# EAGLE design axocore_top_from_mech (EAGLE 7.4.0)
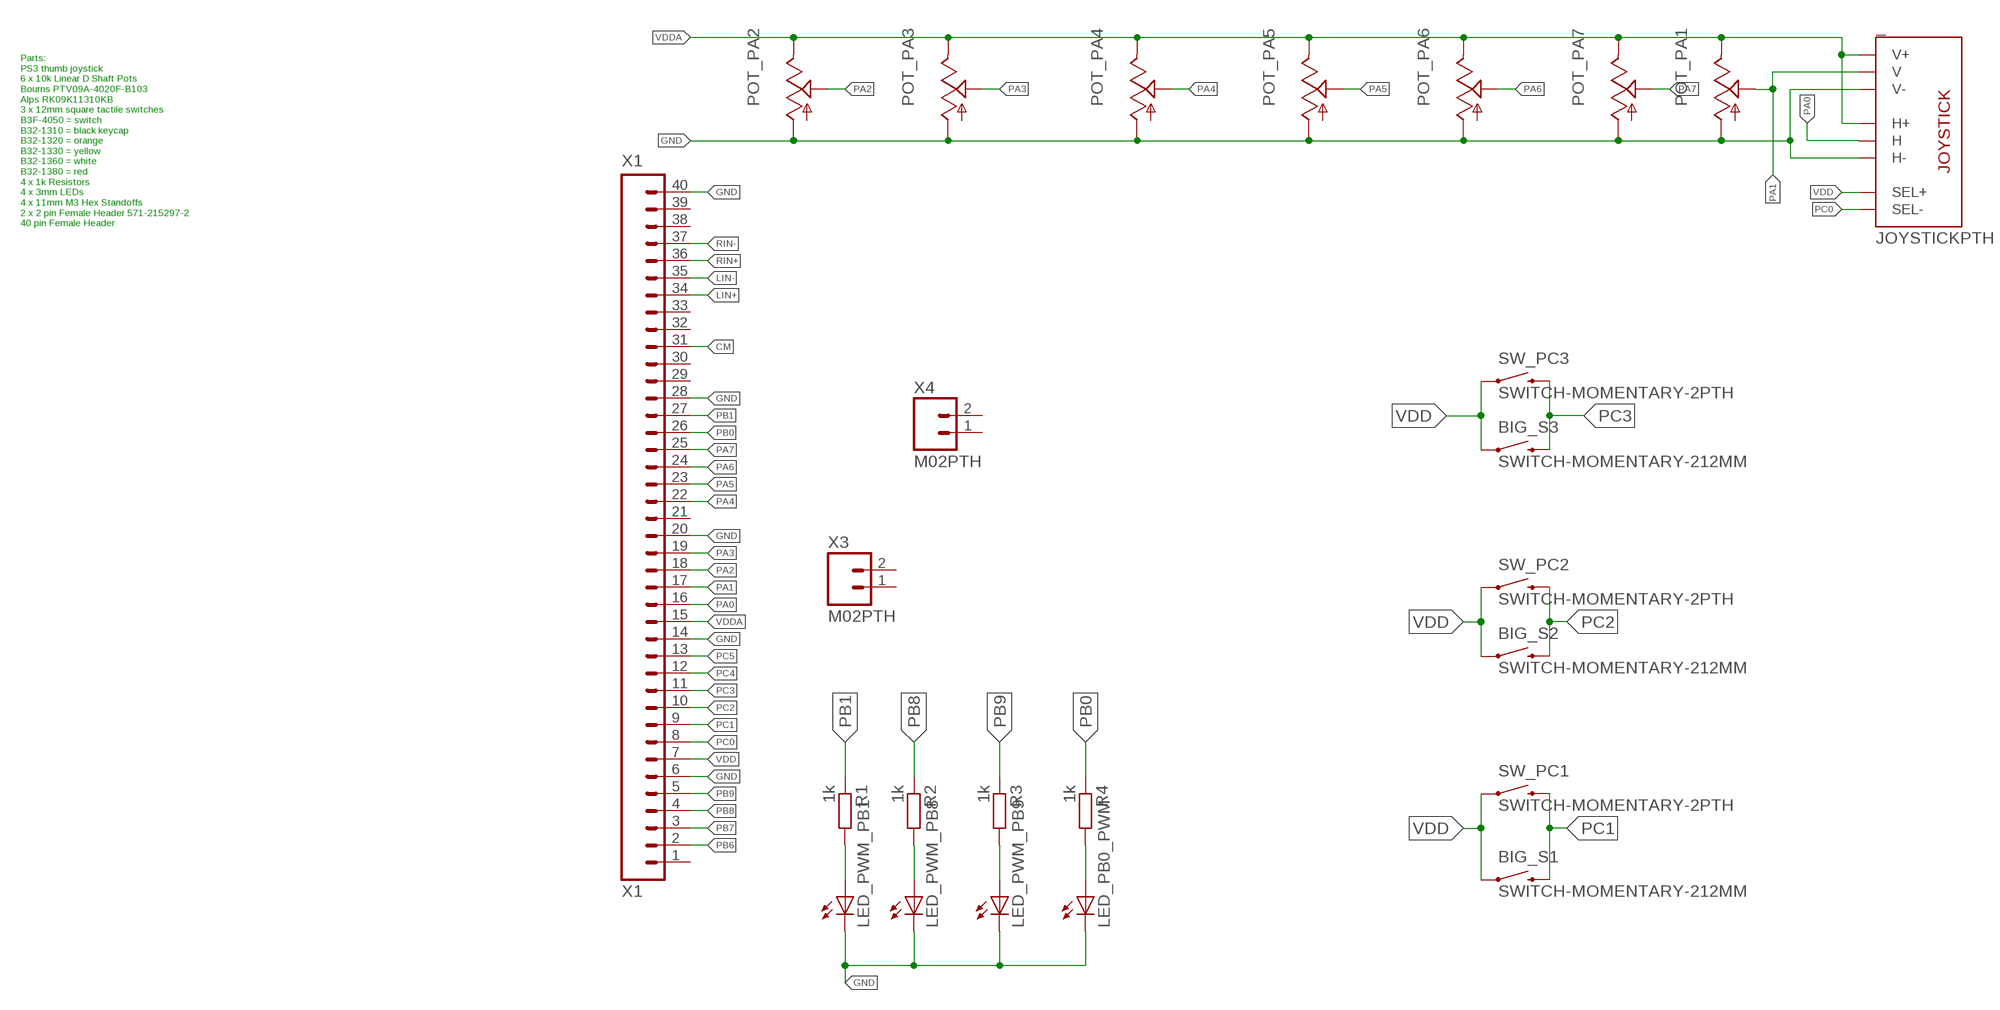
[diagram p0: schematic, sheet 1]

## Parts
_  JOYSTICKPTH  [JOYSTICK]
BIG_S1  SWITCH-MOMENTARY-212MM  [TACTILE-PTH-12MM]
BIG_S2  SWITCH-MOMENTARY-212MM  [TACTILE-PTH-12MM]
BIG_S3  SWITCH-MOMENTARY-212MM  [TACTILE-PTH-12MM]
LED_PB0_PWM  LED3MM  [LED3MM]
LED_PWM_PB1  LED3MM  [LED3MM]
LED_PWM_PB8  LED3MM  [LED3MM]
LED_PWM_PB9  LED3MM  [LED3MM]
POT_PA1  9MM_SNAP-IN_POT_  [9MM_SNAP-IN_POT]
POT_PA2  9MM_SNAP-IN_POT_  [9MM_SNAP-IN_POT]
POT_PA3  9MM_SNAP-IN_POT_  [9MM_SNAP-IN_POT]
POT_PA4  9MM_SNAP-IN_POT_  [9MM_SNAP-IN_POT]
POT_PA5  9MM_SNAP-IN_POT_  [9MM_SNAP-IN_POT]
POT_PA6  9MM_SNAP-IN_POT_  [9MM_SNAP-IN_POT]
POT_PA7  9MM_SNAP-IN_POT_  [9MM_SNAP-IN_POT]
R1  1k  RESISTOR7MM  [7MM_RESISTOR]
R2  1k  RESISTOR7MM  [7MM_RESISTOR]
R3  1k  RESISTOR7MM  [7MM_RESISTOR]
R4  1k  RESISTOR7MM  [7MM_RESISTOR]
SW_PC1  SWITCH-MOMENTARY-2PTH  [TACTILE-PTH]
SW_PC2  SWITCH-MOMENTARY-2PTH  [TACTILE-PTH]
SW_PC3  SWITCH-MOMENTARY-2PTH  [TACTILE-PTH]
X1  X1  M40  [1X40]
X3  M02PTH  [1X02]
X4  M02PTH  [1X02]

## Nets
CM: X1.31
GND: _.H3(H-) _.V3(V-) LED_PB0_PWM.K(C) LED_PWM_PB1.K(C) LED_PWM_PB8.K(C) LED_PWM_PB9.K(C) POT_PA1.1(A) POT_PA2.1(A) POT_PA3.1(A) POT_PA4.1(A) POT_PA5.1(A) POT_PA6.1(A) POT_PA7.1(A) X1.6 X1.14 X1.20 X1.28 X1.40
LIN+: X1.34
LIN-: X1.35
N$7: LED_PWM_PB1.A R1.2
N$8: LED_PWM_PB8.A R2.2
N$9: LED_PWM_PB9.A R3.2
N$10: LED_PB0_PWM.A R4.2
PA0: _.H2(H) X1.16
PA1: _.V2(V) POT_PA1.2(S) X1.17
PA2: POT_PA2.2(S) X1.18
PA3: POT_PA3.2(S) X1.19
PA4: POT_PA4.2(S) X1.22
PA5: POT_PA5.2(S) X1.23
PA6: POT_PA6.2(S) X1.24
PA7: POT_PA7.2(S) X1.25
PB0: R4.1 X1.26
PB1: R1.1 X1.27
PB6: X1.2
PB7: X1.3
PB8: R2.1 X1.4
PB9: R3.1 X1.5
PC0: _.B2A(SEL-) X1.8
PC1: BIG_S1.3 SW_PC1.3 X1.9
PC2: BIG_S2.3 SW_PC2.3 X1.10
PC3: BIG_S3.3 SW_PC3.3 X1.11
PC4: X1.12
PC5: X1.13
RIN+: X1.36
RIN-: X1.37
VDD: _.B1A(SEL+) BIG_S1.1 BIG_S2.1 BIG_S3.1 SW_PC1.1 SW_PC2.1 SW_PC3.1 X1.7
VDDA: _.H1(H+) _.V1(V+) POT_PA1.3(E) POT_PA2.3(E) POT_PA3.3(E) POT_PA4.3(E) POT_PA5.3(E) POT_PA6.3(E) POT_PA7.3(E) X1.15
Unconnected: X1.1 X1.21 X1.29 X1.30 X1.32 X1.33 X1.38 X1.39 X3.1 X3.2 X4.1 X4.2

## Notes on the sheet
- Parts: 
  PS3 thumb joystick 
  6 x 10k Linear D Shaft Pots 
  Bourns PTV09A-4020F-B103
  Alps RK09K11310KB
  3 x 12mm square tactile switches
  B3F-4050 = switch 
  B32-1310 = black keycap 
  B32-1320 = orange 
  B32-1330 = yellow 
  B32-1360 = white
  B32-1380 = red 
  4 x 1k Resistors
  4 x 3mm LEDs
  4 x 11mm M3 Hex Standoffs
  2 x 2 pin Female Header 571-215297-2
  40 pin Female Header

## Library data of the parts
_ = SparkFun-Electromechanical:JOYSTICK: Thumb Joystick Joystick commonly found in PS2 controllers. Two pots and a select switch. Footprint proven. Spark Fun Electronics SKU : COM-09032
BIG_S1-BIG_S3 = SparkFun-Electromechanical:SWITCH-MOMENTARY-2: Various NO switches- pushbuttons, reed, etc; PROD_ID: SWCH-09185
LED_PB0_PWM LED_PWM_PB1 LED_PWM_PB8 LED_PWM_PB9 = SparkFun-LED:LED: LEDs Standard schematic elements and footprints for 5mm, 3mm, 1206, and 0603 sized LEDs. 5mm - Spark Fun Electronics SKU : COM-00529 (and others)
POT_PA1-POT_PA7 = MusicThingModular:9MM_SNAP-IN_POT: 9mm vertical snap-in pot, Alpha / Panasonic style
R1-R4 = MusicThingModular:RESISTOR: Standard resistor, various versions
SW_PC1-SW_PC3 = SparkFun-Electromechanical:SWITCH-MOMENTARY-2: Various NO switches- pushbuttons, reed, etc
X1 = SparkFun-Connectors:M40: 1x40 .1" header
X3 X4 = SparkFun-Connectors:M02: Standard 2-pin 0.1" header. Use with - straight break away headers ( PRT-00116) - right angle break away headers (PRT-00553) - swiss pins (PRT-00743) - machine pins (PRT-00117) - female headers (PRT-00115) Molex polarized connector foot print use with: PRT-08233 with associated crimp pins and housings. 2.54_SCREWTERM for use with PRT-10571. 3.5mm Screw Terminal footprints for PRT-08084 5mm Screw Terminal footprints for use with PRT-08433

## Net classes
0 default: width 0.305 mm

## Board
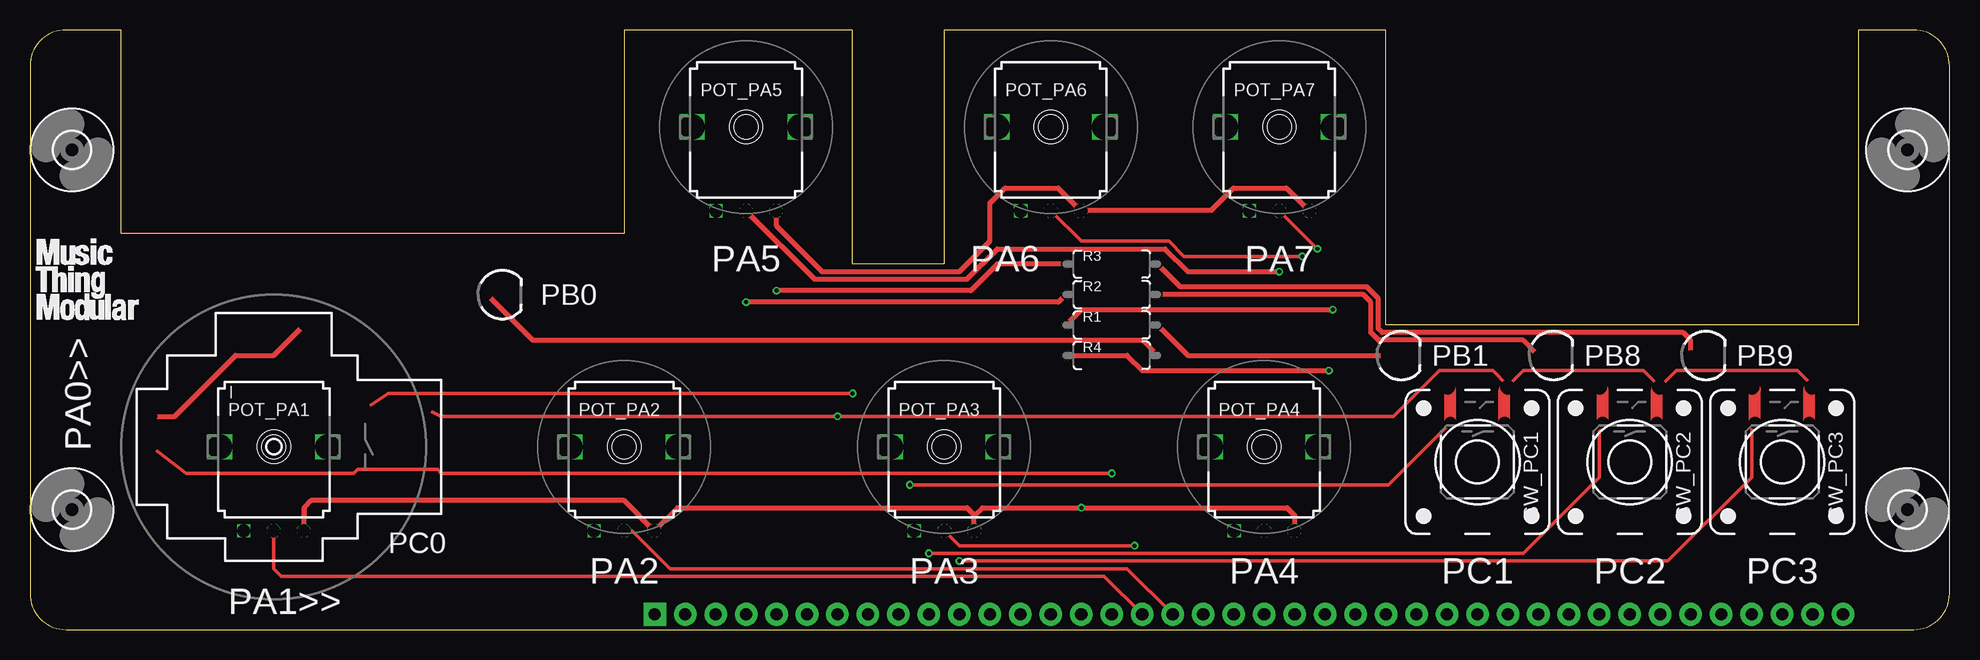
[diagram p1: board, top side]
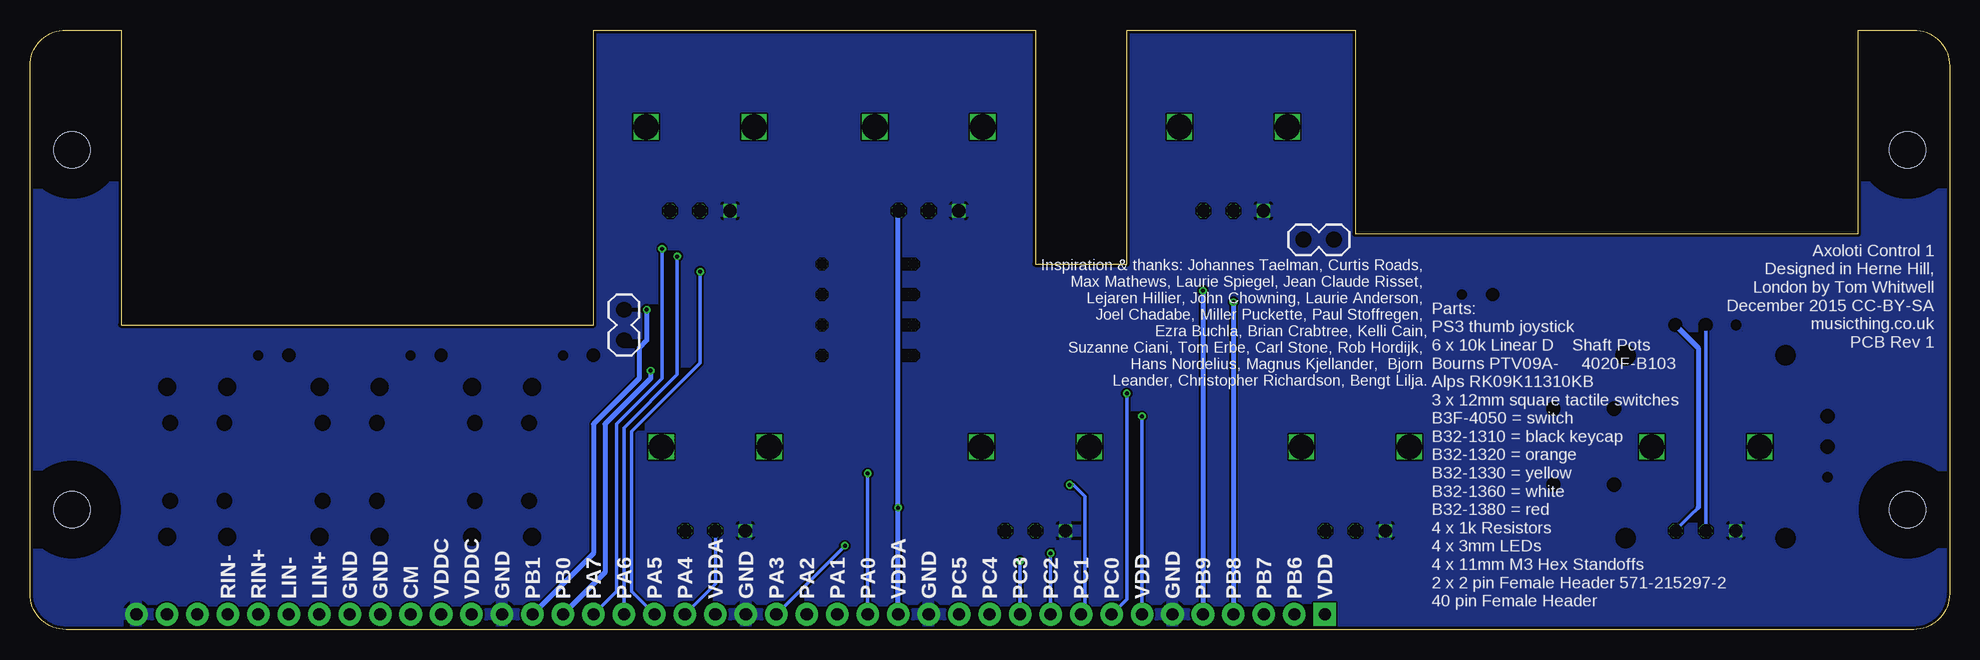
[diagram p2: board, bottom side, seen from below]

Size 160 x 50 mm. Coordinates in mm from the lower left corner, seen from the top.
Outline: 3,0 157,0 arc90 160,3 160,47 arc90 157,50 152.4,50 152.4,25.4 113.03,25.4 113.03,50 76.2,50 76.2,30.48 68.58,30.48 68.58,50 49.53,50 49.53,33.02 7.62,33.02 7.62,50 3,50 arc90 0,47 0,3 arc90 3,0
Copper layers (1*2*15*16): Top 0.035mm / dielectric 0.2mm / Route2 0.0175mm / dielectric 1.1mm / Route15 0.0175mm / dielectric 0.2mm / Bottom 0.035mm
Design rules "SeeedStudio_DRU_no_angle_20130527 *": minimum track width 6mil, minimum drill 12mil, track to track 6mil, track to pad 6mil, pad to pad 6mil, via to via 6mil, smd to smd 0mil, copper to edge 10mil, drill to drill 10mil, minimum pad ring 0mil, minimum via ring 6mil, stop-mask expansion 2mil, vias tented up to drill 25mil, thermal gap 10mil

### Footprints (pad centres in the part's own frame; a part is rotated, then mirrored left to right if it is on the bottom)
JOYSTICK = drill 0.9: B1A -3.175,12.7; B1B 3.175,12.7; B2A -3.175,7.62; B2B 3.175,7.62 | drill 0.889: H1 -2.54,-10.16; H2 0,-10.16; H3 2.54,-10.16; V1 -10.16,2.54; V2 -10.16,0; V3 -10.16,-2.54 | drill 1.397: MOUNT1 -7.62,6.668; MOUNT2 -7.62,-6.668; MOUNT3 7.62,-6.668; MOUNT4 7.62,6.668
TACTILE-PTH-12MM = drill 1.2: 1 6.25,-2.5; 2 -6.25,-2.5; 3 6.25,2.5; 4 -6.25,2.5
3,0 = hole 3: 0,0
LED3MM = drill 0.813: A -1.27,0; K 1.27,0
9MM_SNAP-IN_POT = drill 1.1 square: 1 -2.5,-7 | drill 1.1 octagon: 2 0,-7; 3 2.5,-7 | drill 2.1 square: CHASSIS1 -4.5,0; CHASSIS2 4.5,0
7MM_RESISTOR = drill 0.813 octagon: 1 -3.81,0; 2 3.81,0
TACTILE-PTH = drill 1.016: 1 -3.251,2.261; 2 3.251,2.261; 3 -3.251,-2.261; 4 3.251,-2.261
1X40 = drill 1.016 pad 1.88 square: 1 -49.53,0 | drill 1.016 pad 1.88: 2 -46.99,0; 3 -44.45,0; 4 -41.91,0; 5 -39.37,0; 6 -36.83,0; 7 -34.29,0; 8 -31.75,0; 9 -29.21,0; 10 -26.67,0; 11 -24.13,0; 12 -21.59,0; 13 -19.05,0; 14 -16.51,0; 15 -13.97,0; 16 -11.43,0; 17 -8.89,0; 18 -6.35,0; 19 -3.81,0; 20 -1.27,0; 21 1.27,0; 22 3.81,0; 23 6.35,0; 24 8.89,0; 25 11.43,0; 26 13.97,0; 27 16.51,0; 28 19.05,0; 29 21.59,0; 30 24.13,0; 31 26.67,0; 32 29.21,0; 33 31.75,0; 34 34.29,0; 35 36.83,0; 36 39.37,0; 37 41.91,0; 38 44.45,0; 39 46.99,0; 40 49.53,0
1X02 = drill 1.016: 1 0,0; 2 2.54,0

### Placement (x,y rotation side)
_  20.32,15.24 270 top
BIG_S1  120.65,13.97 90 top
BIG_S2  133.35,13.97 90 top
BIG_S3  146.05,13.97 90 top
H1  MOUNT-HOLE3.0  [3,0]  3.5,10 90 top
H2  MOUNT-HOLE3.0  [3,0]  3.5,40 90 top
H4  MOUNT-HOLE3.0  [3,0]  156.5,10 90 top
H6  MOUNT-HOLE3.0  [3,0]  156.5,40 0 top
LED_PB0_PWM  39.37,27.94 0 top
LED_PWM_PB1  114.3,22.86 0 top
LED_PWM_PB8  127,22.86 0 top
LED_PWM_PB9  139.7,22.86 0 top
POT_PA1  20.32,15.24 0 top
POT_PA2  49.53,15.24 0 top
POT_PA3  76.2,15.24 0 top
POT_PA4  102.87,15.24 0 top
POT_PA5  59.69,41.91 0 top
POT_PA6  85.09,41.91 0 top
POT_PA7  104.14,41.91 0 top
R1  90.17,25.4 0 top
R2  90.17,27.94 0 top
R3  90.17,30.48 0 top
R4  90.17,22.86 0 top
SW_PC1  120.65,13.97 270 top
SW_PC2  133.35,13.97 270 top
SW_PC3  146.05,13.97 270 top
X1  101.6,1.27 0 top
X3  53.85,32.51 0 bottom
X4  110.49,24.13 90 bottom

### Tracks (layer width: path | path; a pad name or v marks a point on that pad's centre or on a via)
GND
  pour Bottom: -5.08,-11.43 166.37,-11.43 166.37,59.69 -5.08,59.69
N$7
  Top 0.406: R1.2 96.52,22.86 LED_PWM_PB1.A
N$8
  Top 0.406: LED_PWM_PB8.A 124.46,24.13 112.39,24.13 111.76,24.77 111.76,27.3 111.12,27.94 R2.2
N$9
  Top 0.406: LED_PWM_PB9.A 138.43,24.13 137.79,24.77 112.71,24.77 112.39,25.08 112.39,27.62 111.44,28.57 95.89,28.57 R3.2
N$10
  Top 0.406: LED_PB0_PWM.A 41.91,24.13 92.71,24.13 R4.2
PA0  (via drill 0.33)
  Top 0.305: _.H2 13.02,13.02 26.99,13.02 27.3,13.34 33.97,13.34 34.29,13.02 v90.17,13.02
  Bottom 0.305: v90.17,13.02 X1.16
PA1
  Top 0.305: POT_PA1.2 20.32,5.08 20.95,4.45 89.53,4.45 X1.17
  Bottom 0.305: _.V2 POT_PA1.2
PA2
  Top 0.305: POT_PA2.2 50.18,8.24 53.34,5.08 91.44,5.08 X1.18
PA3  (via drill 0.33)
  Top 0.305: POT_PA3.2 76.22,8.24 77.47,6.99 v92.08,6.99
  Bottom 0.305: v92.08,6.99 X1.19
PA4
  Bottom 0.305: POT_PA4.2 102.87,3.81 X1.22
PA5  (via drill 0.33)
  Top 0.305: POT_PA5.2 59.7,34.91
  Top 0.406: 59.7,34.91 65.41,29.21 78.11,29.21 80.64,31.75 94.61,31.75 96.52,29.84 v104.14,29.84
  Bottom 0.305: v104.14,29.84 104.14,22.23 109.86,16.51 109.86,3.17 X1.23
PA6  (via drill 0.33)
  Top 0.305: POT_PA6.2 85.11,34.91 87.63,32.38 94.93,32.38 96.2,31.11 v106.05,31.11
  Bottom 0.305: v106.05,31.11 106.05,21.27 110.49,16.83 X1.24
PA7  (via drill 0.33)
  Top 0.305: POT_PA7.2 104.16,34.91 v107.31,31.75
  Bottom 0.305: v107.31,31.75 107.31,20.95 111.12,17.14 111.12,3.17 X1.25
PB0  (via drill 0.33)
  Top 0.406: R4.1 91.44,22.86 92.71,21.59 v108.27,21.59
  Bottom 0.406: v108.27,21.59 108.27,20.95 112.08,17.14 112.08,4.76 X1.26
PB1  (via drill 0.33)
  Top 0.406: R1.1 87.63,26.67 v108.58,26.67
  Bottom 0.406: v108.58,26.67 108.58,24.13 109.22,23.5 109.22,20.95 113.03,17.14 113.03,6.35 X1.27
PB8  (via drill 0.33)
  Top 0.406: R2.1 85.72,27.3 v59.69,27.3
  Bottom 0.406: v59.69,27.3 X1.4
PB9  (via drill 0.33)
  Top 0.406: R3.1 80.64,30.48 78.42,28.26 v62.23,28.26
  Bottom 0.406: v62.23,28.26 X1.5
PC0  (via drill 0.33)
  Top 0.305: _.B2A 29.84,19.68 v68.58,19.68
  Bottom 0.305: v68.58,19.68 68.58,2.54 X1.8
PC1  (via drill 0.33)
  Top 0.305: v73.34,12.06 113.23,12.06 SW_PC1.3 | 118.39,19.98 BIG_S1.3
  Top 1.016: SW_PC1.3 118.39,19.98
  Bottom 0.305: v73.34,12.06 73.03,12.06 72.07,11.11 72.07,2.22 X1.9
PC2  (via drill 0.33)
  Top 0.305: 131.09,19.98 BIG_S2.3 | SW_PC2.3 131.09,16.79 130.81,16.51 130.81,12.7 124.46,6.35 v74.93,6.35
  Top 1.016: SW_PC2.3 131.09,19.98
  Bottom 0.305: v74.93,6.35 X1.10
PC3  (via drill 0.33)
  Top 0.305: 143.79,19.98 BIG_S3.3 | SW_PC3.3 143.59,17.22 143.51,17.14 143.51,12.7 136.53,5.71 v77.47,5.71
  Top 1.016: SW_PC3.3 143.79,19.98
  Bottom 0.305: v77.47,5.71 X1.11
VDD  (via drill 0.33)
  Top 0.305: _.B1A 34.29,17.78 v67.31,17.78 113.67,17.78 117.47,21.59 121.92,21.59 123.15,20.36 BIG_S1.1 | BIG_S1.1 123.15,20.28 124.46,21.59 134.48,21.59 BIG_S2.1 | BIG_S2.1 137.22,21.59 147.32,21.59 148.55,20.36 BIG_S3.1 148.31,19.98 | 135.61,19.98 BIG_S2.1 | 122.91,19.98 BIG_S1.1
  Top 1.016: SW_PC3.1 148.31,19.98 | SW_PC2.1 135.61,19.98 | SW_PC1.1 122.91,19.98
  Bottom 0.305: X1.7 v67.31,17.78
VDDA  (via drill 0.33)
  Top 0.305: POT_PA1.3 22.84,8.24 | 78.7,9.48 78.74,9.53 | 105.41,8.28 POT_PA4.3 | 49.48,10.79 49.53,10.79 52.07,8.26
  Top 0.406: 22.86,10.16 POT_PA1.3 | 22.84,8.24 22.86,10.16 | 22.86,10.16 23.5,10.79 49.48,10.79 POT_PA2.3 | _.H1 12.06,17.78 17.14,22.86 20.32,22.86 _.V1 | POT_PA5.3 62.19,33.7 66.04,29.84 77.47,29.84 80.01,32.38 80.01,35.56 81.28,36.83 85.72,36.83 85.72,36.77 POT_PA6.3 87.63,34.95 98.45,34.95 100.33,36.83 104.72,36.83 POT_PA7.3 | POT_PA3.3 78.7,9.48 | 105.41,8.28 105.41,9.53 104.78,10.16 v87.63,10.16 79.38,10.16 78.74,9.53 78.11,10.16 53.98,10.16 52.07,8.26
  Bottom 0.305: 20.95,10.16 21.59,9.53 22.86,8.28 POT_PA1.3 | 87.63,34.95 POT_PA6.3 87.63,34.87
  Bottom 0.406: _.V1 20.95,23.5 20.95,10.16 | X1.15 v87.63,10.16 87.63,34.87

### Text on the board
tPlace: PA5 | PA6 | PA7 | PB0 | PB1 | PB8 | PB9 | PA0>> | PC0 | PA2 | PA3 | PA4 | PC1 | PC2 | PC3 | PA1>>
bPlace: Axoloti Control 1 / Designed in Herne Hill, / London by Tom Whitwell / December 2015 CC-BY-SA / musicthing.co.uk / PCB Rev 1 | Inspiration & thanks: Johannes Taelman, Curtis Roads, / Max Mathews, Laurie Spiegel, Jean Claude Risset, / Lejaren Hillier, John Chowning, Laurie Anderson, / Joel Chadabe, Miller Puckette, Paul Stoffregen, / Ezra Buchla, Brian Crabtree, Kelli Cain, / Suzanne Ciani, Tom Erbe, Carl Stone, Rob Hordijk, / Hans Nordelius, Magnus Kjellander, Bjorn / Leander, Christopher Richardson, Bengt Lilja. | Parts: / PS3 thumb joystick / 6 x 10k Linear D Shaft Pots / Bourns PTV09A- 4020F-B103 / Alps RK09K11310KB / 3 x 12mm square tactile switches / B3F-4050 = switch / B32-1310 = black keycap / B32-1320 = orange / B32-1330 = yellow / B32-1360 = white / B32-1380 = red / 4 x 1k Resistors / 4 x 3mm LEDs / 4 x 11mm M3 Hex Standoffs / 2 x 2 pin Female Header 571-215297-2 / 40 pin Female Header
bNames: VDD | PB6 | PB7 | PB8 | PB9 | GND | VDD | PC0 | PC1 | PC2 | PC3 | PC4 | PC5 | GND | VDDA | PA0 | PA1 | PA2 | PA3 | GND | VDDA | PA4 | PA5 | PA6 | PA7 | PB0 | PB1 | GND | VDDC | VDDC | CM | GND | GND | LIN+ | LIN- | RIN+ | RIN-
tDocu: VDD | PB6 | PB7 | PB8 | PB9 | GND | VDD | PC0 | PC1 | PC2 | PC3 | PC4 | PC5 | GND | VDDA | PA0 | PA1 | PA2 | PA3 | GND | VDDA | PA4 | PA5 | PA6 | PA7 | PB0 | PB1 | GND | VDDC | VDDC | CM | GND | GND | LIN+ | LIN- | RIN+ | RIN-